# EAGLE design Puzzle LED Bar-v2.0 (EAGLE 6.6.0)
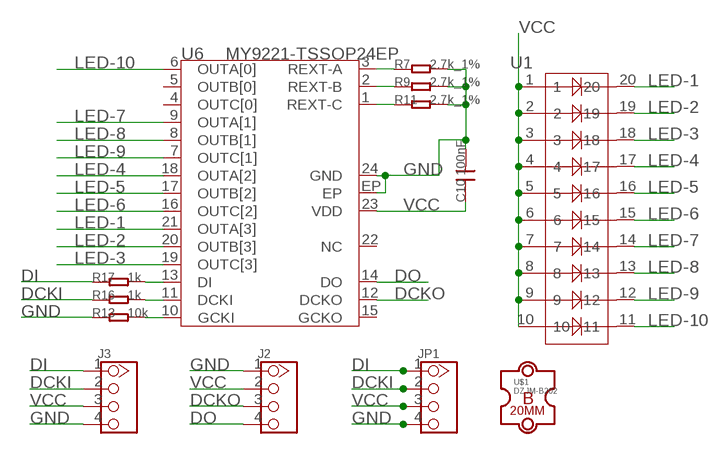
[diagram p0: schematic, sheet 1]

## Parts
C10  100nF  C-0603  [0603]
J2  HEADER-4P-90D  [4P-2.54-90]
J3  HEADER-4P'2.54-90D-FEMALE'  [4P-2.54-90D-FEMALE]
JP1  M0410  [JMZY-1X4]
R7  2.7k_1%  R-0603  [0603]
R9  2.7k_1%  R-0603  [0603]
R11  2.7k_1%  R-0603  [0603]
R13  10k  R-0603  [0603]
R16  1k  R-0603  [0603]
R17  1k  R-0603  [0603]
U1  LED-20P  [20P-DIP-2.54-25.5X10.1X8.4H]
U6  MY9221-TSSOP24EP  [TSSOP24EP]
U$1  DZJM-B202  [DZJM-B20-2P]

## Nets
DCKI: J3.2 JP1.2 R16.1
DCKO: J2.3 U6.12(DCKO)
DI: J3.1 JP1.1 R17.1
DO: J2.4 U6.14(DO)
GND: C10.2 J2.1 J3.4 JP1.4 R7.2 R9.2 R11.2 R13.1 U6.24(GND) U6.EP
LED-1: U1.20 U6.21(OUTA[3])
LED-2: U1.19 U6.20(OUTB[3])
LED-3: U1.18 U6.19(OUTC[3])
LED-4: U1.17 U6.18(OUTA[2])
LED-5: U1.16 U6.17(OUTB[2])
LED-6: U1.15 U6.16(OUTC[2])
LED-7: U1.14 U6.9(OUTA[1])
LED-8: U1.13 U6.8(OUTB[1])
LED-9: U1.12 U6.7(OUTC[1])
LED-10: U1.11 U6.6(OUTA[0])
N$1: R17.2 U6.13(DI)
N$2: R16.2 U6.11(DCKI)
N$4: R13.2 U6.10(GCKI)
N$7: R11.1 U6.1(REXT-C)
N$8: R9.1 U6.2(REXT-B)
N$9: R7.1 U6.3(REXT-A)
VCC: C10.1 J2.2 J3.3 JP1.3 U1.1 U1.2 U1.3 U1.4 U1.5 U1.6 U1.7 U1.8 U1.9 U1.10 U6.23(VDD)
Unconnected: U6.4(OUTC[0]) U6.5(OUTB[0]) U6.15(GCKO) U6.22(NC)

## Library data of the parts
C10 = Discrete:C*: Ceramic Capacitors
J2 J3 = Connector:HEADER-4P
JP1 = duinofun-connector:M04: Header 4 Standard 4-pin 0.1" header. Use with straight break away headers (SKU : PRT-00116), right angle break away headers (PRT-00553), swiss pins (PRT-00743), machine pins (PRT-00117), and female headers (PRT-00115). Molex polarized connector foot print use with SKU : PRT-08231 with associated crimp pins and housings. 1MM SMD Version SKU: PRT-10208
R7 R9 R11 R13 R16 R17 = Discrete:R*
U1 = Module:LED-20P
U6 = For_Test_Albert:MY9221
U$1 = duinofun-outline:DZJM-B20

## Net classes
0 default: width 0.203 mm, drill 0.305 mm, clearance 0.152 mm

## Board
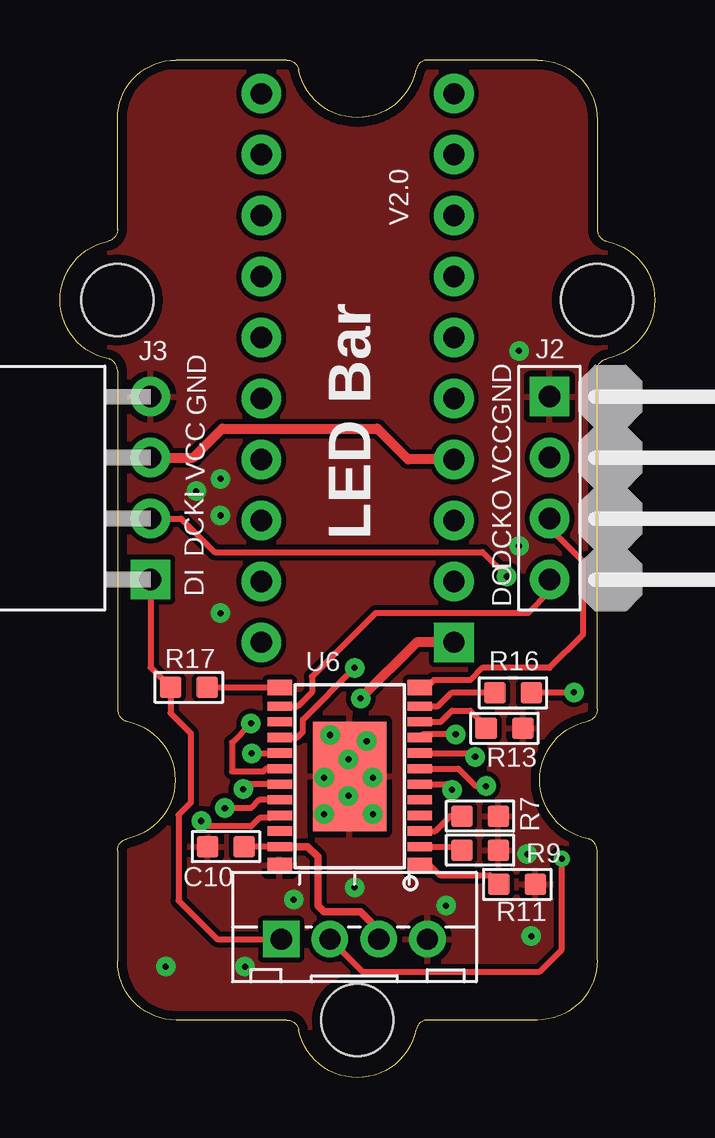
[diagram p1: board, top side]
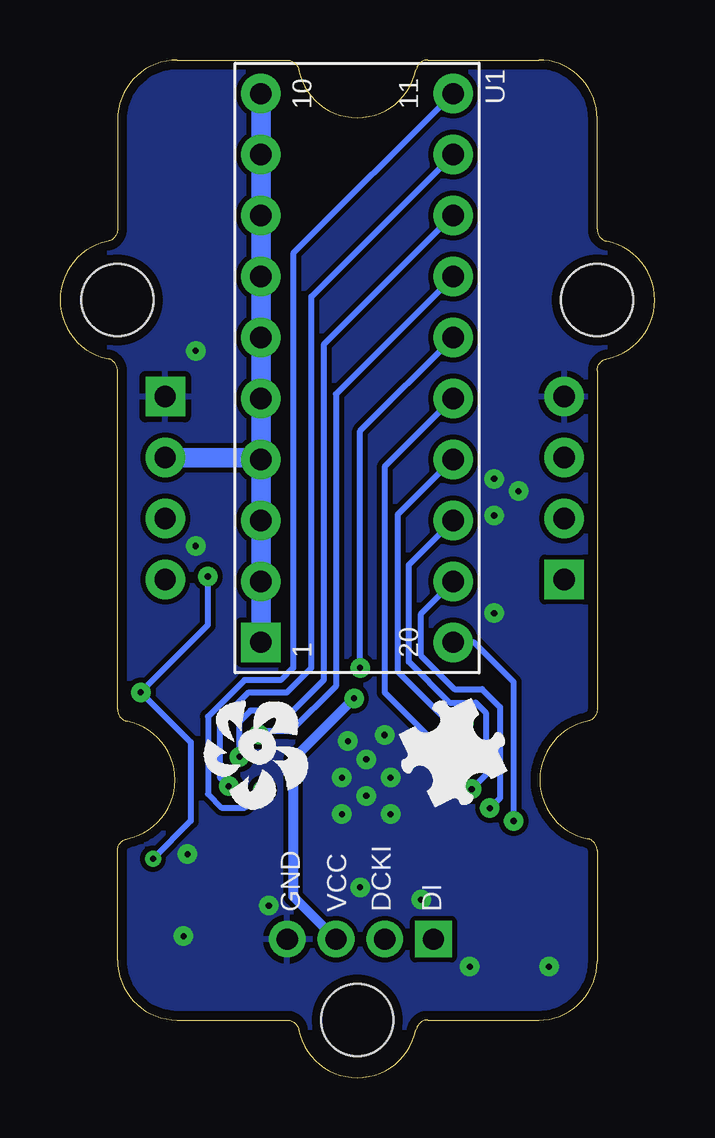
[diagram p2: board, bottom side, seen from below]

Size 24.8 x 42.4 mm. Coordinates in mm from the lower left corner, seen from the top.
Copper layers (1*16): Top 0.035mm / dielectric 1.5mm / Bottom 0.035mm
Design rules "default *": minimum track width 10mil, minimum drill 10mil, track to track 8mil, track to pad 8mil, pad to pad 8mil, via to via 8mil, smd to smd 8mil, copper to edge 15mil, drill to drill 8mil, minimum pad ring 10mil, minimum via ring 8mil, stop-mask expansion 4mil, vias tented up to drill 25mil, thermal gap 10mil

### Footprints (pad centres in the part's own frame; a part is rotated, then mirrored left to right if it is on the bottom)
0603 = smd 0.889 x 0.889: 1 -0.762,0; 2 0.762,0
4P-2.54-90 = drill 0.889 pad 1.651 square: 1 0,3.81 | drill 0.889 pad 1.651: 2 0,1.27; 3 0,-1.27; 4 0,-3.81
4P-2.54-90D-FEMALE = drill 0.889 pad 1.651 square: 1 0,3.81 | drill 0.889 pad 1.651: 2 0,1.27; 3 0,-1.27; 4 0,-3.81
JMZY-1X4 = drill 0.889 pad 1.524 square: 1 2.032,1.778 | drill 0.889 pad 1.524: 2 4.064,1.778; 3 6.096,1.778; 4 8.128,1.778
20P-DIP-2.54-25.5X10.1X8.4H = drill 0.889 pad 1.651 square: 1 -11.43,4.013 | drill 0.889 pad 1.651: 2 -8.89,4.013; 3 -6.35,4.013; 4 -3.81,4.013; 5 -1.27,4.013; 6 1.27,4.013; 7 3.81,4.013; 8 6.35,4.013; 9 8.89,4.013; 10 11.43,4.013; 11 11.43,-4.013; 12 8.89,-4.013; 13 6.35,-4.013; 14 3.81,-4.013; 15 1.27,-4.013; 16 -1.27,-4.013; 17 -3.81,-4.013; 18 -6.35,-4.013; 19 -8.89,-4.013; 20 -11.43,-4.013
TSSOP24EP = smd 0.635 x 1.016: 1 -3.702,-2.921; 12 3.702,-2.921; 13 3.702,2.921; 24 -3.702,2.921 | smd 0.381 x 1.016: 2 -2.925,-2.921; 3 -2.275,-2.921; 4 -1.625,-2.921; 5 -0.975,-2.921; 6 -0.325,-2.921; 7 0.325,-2.921; 8 0.975,-2.921; 9 1.625,-2.921; 10 2.275,-2.921; 11 2.925,-2.921; 14 2.925,2.921; 15 2.275,2.921; 16 1.625,2.921; 17 0.975,2.921; 18 0.325,2.921; 19 -0.325,2.921; 20 -0.975,2.921; 21 -1.625,2.921; 22 -2.275,2.921; 23 -2.925,2.921 | smd 4.572 x 3.048: EP 0,0
DZJM-B20-2P = hole 3: -10,10; -10,-10; 20,0

### Placement (x,y rotation side)
C10  6.93,9.63 180 top
J2  20.41,24.56 0 top
J3  3.78,24.56 180 top
JP1  7.19,3.99 0 top
R7  17.52,10.9 0 top
R9  17.52,9.48 0 top
R11  19.07,8.05 0 top
R13  18.53,14.56 180 top
R16  18.89,16.03 180 top
R17  5.38,16.26 0 top
U1  12.41,29.57 90 bottom
U6  12.08,12.55 90 top
U$1  12.4,22.4 270 top
U$2  [BRICK-LOGO-MIL-0.5]  10.94,10.99 0 bottom
U$3  [DUINOFUN-LOGO-PCB-0.6]  14.42,11.13 90 bottom

### Tracks (layer width: path | path; a pad name or v marks a point on that pad's centre or on a via)
DCKI  (via drill 0.25, 0.25 pad 0.81)
  Top 0.254: v20.92,9.12 20.92,5.34 20,4.42 12.61,4.42 JP1.2 | J3.2 5.05,23.29 6.44,21.9 17.62,21.9 v18.63,20.88 | 19.65,15.8 R16.1 19.68,16.05 v21.43,16.05
  Bottom 0.254: v18.63,20.88 18.63,18.85 v21.43,16.05 19.35,13.97 19.35,10.69 v20.92,9.12
DCKO
  Top 0.254: U6.12 15.28,16.25 15.59,16.56 17.11,16.56 17.62,17.07 20.41,17.07 21.8,18.46 21.8,21.52 20.41,22.91 J2.3
DI
  Top 0.254: J3.1 3.78,17.1 R17.1 4.61,15.19 5.46,14.35 5.46,11.46 4.94,10.95 4.94,7.37 6.54,5.77 JP1.1
DO
  Top 0.254: J2.4 20.41,20.25 19.52,19.36 13.16,19.36 10.51,16.7 10.51,16.05 9.93,15.47 U6.14
GND  (via drill 0.25 pad 0.81)
  other vias: 19.65,5.89 19.14,30.28 9.74,7.42 11.01,10.97 13.05,10.97 12.03,11.74 13.05,12.5 11.01,12.5 11.27,14.28 12.03,13.26 12.28,7.93 4.41,4.62 7.71,4.62 6.7,24.94 6.7,23.42 5.68,24.44 12.79,14.02 16.09,7.16 19.48,9.31 19.14,22.15 6.7,19.36
  pour Bottom: -0.03,42.47 24.73,42.47 24.73,0.31 -0.03,0.31
  pour Top: -0.03,42.47 24.73,42.47 24.73,0.31 -0.03,0.31
LED-1  (via drill 0.25 pad 0.81)
  Top 0.254: U6.21 8.86,10.92 8.75,10.82 8.32,10.82 7.97,10.47 5.89,10.47 v5.89,10.69
  Bottom 0.254: U1.20 7.54,18.14 5.89,16.48 v5.89,10.69
LED-2  (via drill 0.25 pad 0.81)
  Top 0.254: U6.20 8.31,11.57 7.97,11.23 v6.87,11.23
  Bottom 0.254: U1.19 9.74,19.33 9.74,17.58 8.36,16.19 7.2,16.19 6.45,15.44 6.45,11.65 v6.87,11.23
LED-3  (via drill 0.25 pad 0.81)
  Top 0.254: U6.19 7.84,12.22 v7.64,12.02
  Bottom 0.254: 7.61,11.99 v7.64,12.02 7.04,12.61 7.04,15.2 7.46,15.63 8.55,15.63 10.25,17.32 10.25,21.36 U1.18
LED-4  (via drill 0.25 pad 0.81)
  Top 0.254: 9.14,12.85 U6.18 8.6,12.87 8.47,12.75 7.17,12.75 7.17,13.96 v7.97,14.76
  Bottom 0.254: U1.17 8.42,25.76 10.71,23.47 10.71,16.91 8.55,14.76 v7.97,14.76
LED-5  (via drill 0.25 pad 0.81)
  Top 0.254: v7.99,13.51 9.15,13.51 U6.17
  Bottom 0.254: U1.16 8.42,28.3 11.27,25.45 11.27,16.05 8.73,13.51 v7.99,13.51
LED-6  (via drill 0.25 pad 0.81)
  Top 0.254: U6.16 | U6.16 9.9,14.17 10.13,14.4 10.13,14.91 v12.28,17.07
  Bottom 0.254: v12.28,17.07 12.28,26.95 U1.15
LED-7  (via drill 0.25 pad 0.81)
  Top 0.254: v16.5,14.3 15.13,14.3 U6.9
  Bottom 0.254: U1.14 13.3,28.48 13.3,16.31 15.18,14.43 16.37,14.43 v16.5,14.3
LED-8  (via drill 0.25 pad 0.81)
  Top 0.254: U6.8 17.15,13.52 v17.31,13.36
  Bottom 0.254: U1.13 8.4,35.94 13.81,30.53 13.81,16.56 15.08,15.29 16.86,15.29 17.31,14.84 v17.31,13.36
LED-9  (via drill 0.25 pad 0.81)
  Top 0.254: U6.7 16.61,12.87 17.34,12.15 v17.76,12.15
  Bottom 0.254: U1.12 14.32,32.54 14.32,17.07 15.33,16.05 16.93,16.05 18.14,14.84 18.14,12.52 v17.76,12.15
LED-10  (via drill 0.25 pad 0.81)
  Top 0.254: 16.17,12.19 16.35,12.02 v16.35,11.99 16.11,12.22 U6.6
  Bottom 0.254: U1.11 8.42,41 15.08,34.34 15.08,17.07 15.59,16.56 17.11,16.56 18.63,15.04 18.63,11.82 18.07,11.25 17.09,11.25 v16.35,11.99 16.5,11.84
N$1
  Top 0.254: R17.2 U6.13
N$2
  Top 0.254: R16.2 16.32,16.03 15.77,15.47 U6.11
N$4
  Top 0.254: U6.10 15.88,14.82 16.35,15.29 17.11,15.29 17.77,14.63 R13.2
N$7
  Top 0.254: U6.1 15.43,8.85 15.84,8.43 17.92,8.43 R11.1
N$8
  Top 0.254: U6.2 16.61,9.62 R9.1
N$9
  Top 0.254: R7.1 16.27,10.9 15.65,10.27 U6.3
VCC  (via drill 0.25 pad 0.81)
  Top 0.254: U6.23 C10.1
  Top 0.305: U6.23 10.33,9.62 10.76,9.2 10.76,7.16 11.01,6.91 12.54,6.91 13.29,6.16 JP1.3
  Top 0.406: J3.3 5.55,25.83 6.76,27.04 13.23,27.04 14.52,25.76 U1.4 | U1.1 14.88,18.14 v12.54,15.8
  Bottom 0.406: v12.54,15.8 15.08,13.26 15.08,7.56 JP1.3
  Bottom 0.813: U1.10 U1.9 U1.8 U1.7 U1.6 U1.5 U1.4 | U1.4 U1.3 U1.2 U1.1 | J2.2 16.5,25.83 U1.4

### Text on the board
tPlace: V2.0 | GND | GND | VCC | VCC | DCKO | DCKI | LED Bar | DI | DO
bPlace: DI | DCKI | VCC | GND